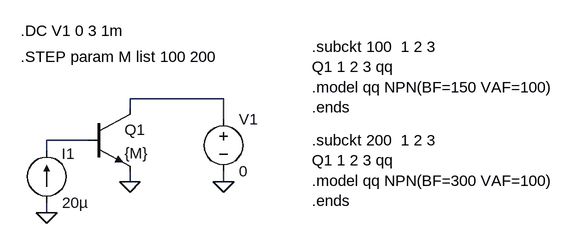
[diagram p0: schematic stepping_subckt.asc]
stepping_subckt.asc, the LTspice schematic file:
Version 4
SHEET 1 1012 680
WIRE 304 208 160 208
WIRE 160 224 160 208
WIRE 304 240 304 208
WIRE 96 272 32 272
WIRE 32 288 32 272
WIRE 160 336 160 320
WIRE 304 336 304 320
WIRE 32 384 32 368
FLAG 32 384 0
FLAG 160 336 0
FLAG 304 336 0
SYMBOL npn 96 224 R0
SYMATTR InstName Q1
SYMATTR Value {M}
SYMATTR Prefix X
SYMBOL voltage 304 224 R0
SYMATTR InstName V1
SYMATTR Value 0
SYMBOL current 32 368 M180
WINDOW 0 23 75 Left 0
WINDOW 3 24 0 Left 0
WINDOW 123 0 0 Left 0
WINDOW 39 0 0 Left 0
SYMATTR InstName I1
SYMATTR Value 20µ
TEXT -8 104 Left 0 !.DC V1 0 3 1m
TEXT -8 144 Left 0 !.STEP param M list 100 200
TEXT 440 128 Left 0 !.subckt 100  1 2 3\nQ1 1 2 3 qq\n.model qq NPN(BF=150 VAF=100)\n.ends
TEXT 440 272 Left 0 !.subckt 200  1 2 3\nQ1 1 2 3 qq\n.model qq NPN(BF=300 VAF=100)\n.ends

The netlist it stands for:
* stepping_subckt.asc
XQ1 N001 N002 0 {M}  ; pins C B E
V1 N001 0 0
I1 0 N002 20µ
.DC V1 0 3 1m
.STEP param M list 100 200
.subckt 100  1 2 3
Q1 1 2 3 qq
.model qq NPN(BF=150 VAF=100)
.ends
.subckt 200  1 2 3
Q1 1 2 3 qq
.model qq NPN(BF=300 VAF=100)
.ends
.backanno
.end